# EAGLE design ProgrammerBoardV1 (EAGLE 8.0.1)
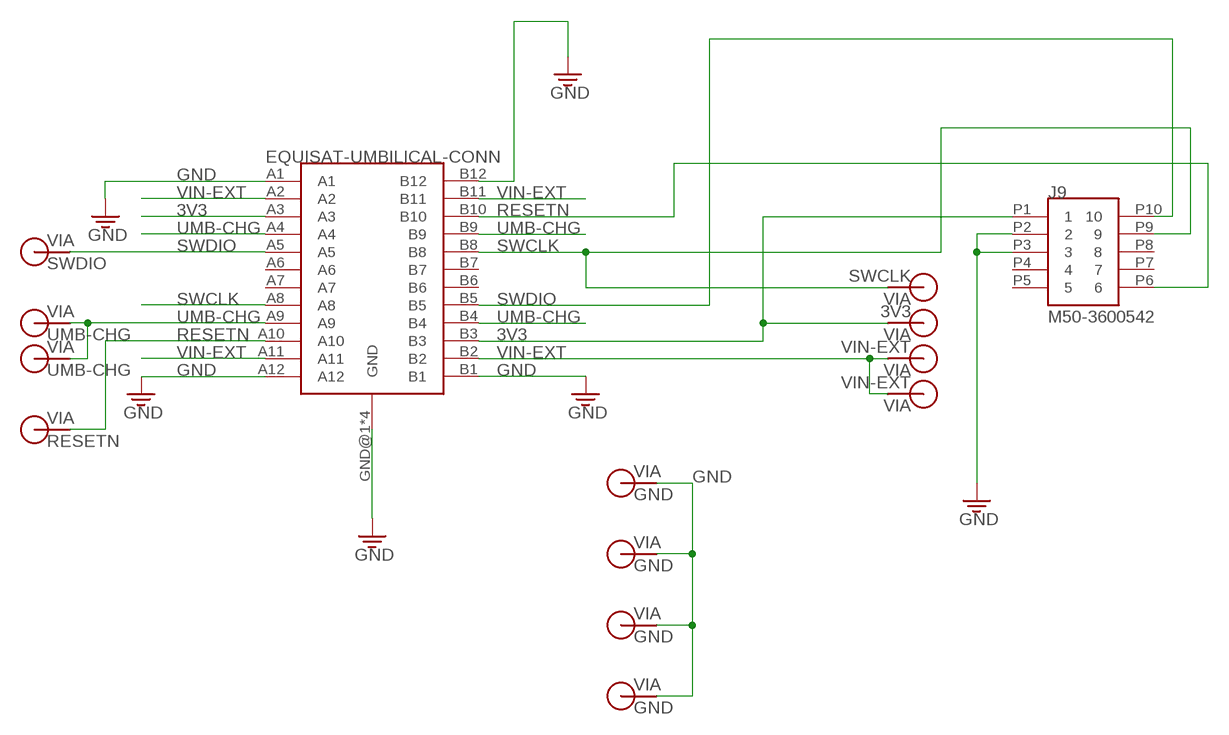
[diagram p0: schematic, sheet 1]

## Parts
J9  M50-3600542  10PINMALE  [10PINMALE]
U$1  EQUISAT-UMBILICAL-CONN  [USB-C-RCPT-SMT]
V1  GND  VIA-60MIL  [VIA-60MIL]
V2  GND  VIA-60MIL  [VIA-60MIL]
V3  GND  VIA-60MIL  [VIA-60MIL]
V4  GND  VIA-60MIL  [VIA-60MIL]
V5  SWDIO  VIA-60MIL  [VIA-60MIL]
V6  UMB-CHG  VIA-60MIL  [VIA-60MIL]
V7  UMB-CHG  VIA-60MIL  [VIA-60MIL]
V8  RESETN  VIA-60MIL  [VIA-60MIL]
V9  SWCLK  VIA-60MIL  [VIA-60MIL]
V10  3V3  VIA-60MIL  [VIA-60MIL]
V11  VIN-EXT  VIA-60MIL  [VIA-60MIL]
V12  VIN-EXT  VIA-60MIL  [VIA-60MIL]

## Nets
3V3: J9.P1 U$1.A3 U$1.B3 V10.P$1
GND: J9.P2 J9.P3 U$1.A1 U$1.A12 U$1.B1 U$1.B12 U$1.GND@1(GND) U$1.GND@2(GND) U$1.GND@3(GND) U$1.GND@4(GND) V1.P$1 V2.P$1 V3.P$1 V4.P$1
RESETN: J9.P6 U$1.A10 U$1.B10 V8.P$1
SWCLK: J9.P9 U$1.A8 U$1.B8 V9.P$1
SWDIO: J9.P10 U$1.A5 U$1.B5 V5.P$1
UMB-CHG: U$1.A4 U$1.A9 U$1.B4 U$1.B9 V6.P$1 V7.P$1
VIN-EXT: U$1.A2 U$1.A11 U$1.B2 U$1.B11 V11.P$1 V12.P$1
Unconnected: J9.P4 J9.P5 J9.P7 J9.P8 U$1.A6 U$1.A7 U$1.B6 U$1.B7

## Library data of the parts
J9 = BrownSpaceEngineering:10PINMALE
U$1 = BrownSpaceEngineering:EQUISAT-UMBILICAL-CONN
V1-V12 = BrownSpaceEngineering:VIA

## Board
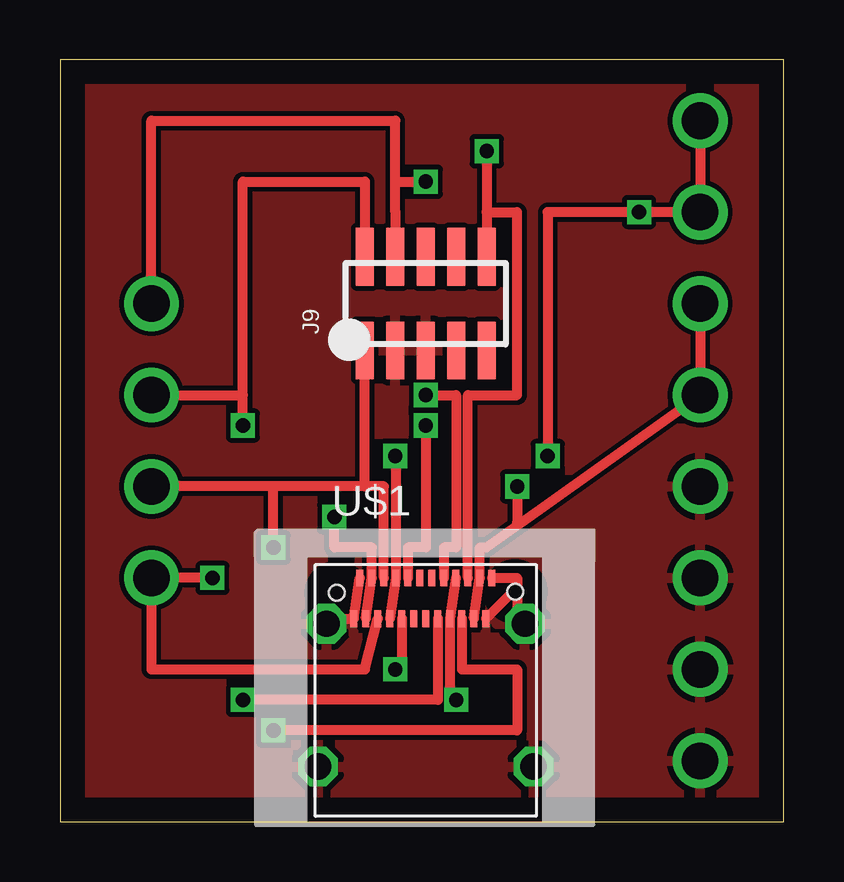
[diagram p1: board, top side]
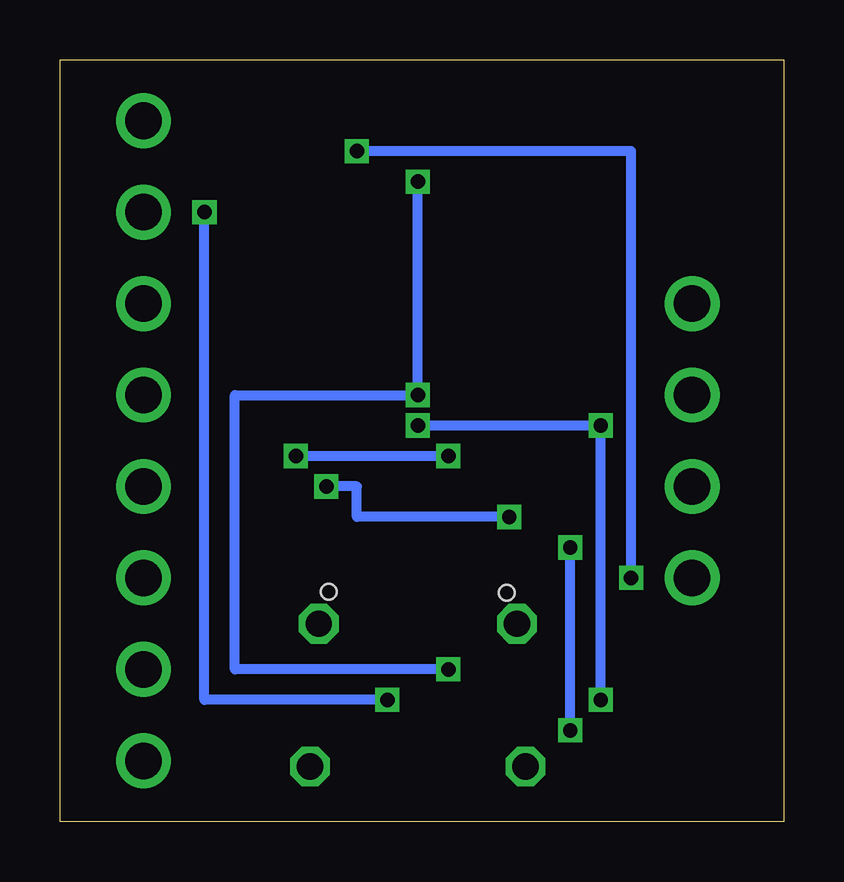
[diagram p2: board, bottom side, seen from below]

Size 30.15 x 31.74 mm. Coordinates in mm from the lower left corner, seen from the top.
Outline: 0,0 30.15,0 30.15,31.74 0,31.74 0,0
Copper layers (1*16): Top 0.035mm / dielectric 1.5mm / Bottom 0.035mm
Design rules "default": minimum track width 10mil, minimum drill 24mil, track to track 8mil, track to pad 8mil, pad to pad 8mil, via to via 8mil, smd to smd 8mil, copper to edge 40mil, drill to drill 8mil, minimum pad ring 10mil, minimum via ring 8mil, stop-mask expansion 4mil, vias tented up to drill 0mil, thermal gap 10mil

### Footprints (pad centres in the part's own frame; a part is rotated, then mirrored left to right if it is on the bottom)
10PINMALE = smd 0.74 x 2.4: P1 -2.54,-1.95; P2 -1.27,-1.95; P3 0,-1.95; P4 1.27,-1.95; P5 2.54,-1.95; P6 2.54,1.95; P7 1.27,1.95; P8 0,1.95; P9 -1.27,1.95; P10 -2.54,1.95
USB-C-RCPT-SMT = smd 0.3 x 0.7: A1 -2.75,0; A2 -2.25,0; A3 -1.75,0; A4 -1.25,0; A5 -0.75,0; A6 -0.25,0; A7 0.25,0; A8 0.75,0; A9 1.25,0; A10 1.75,0; A11 2.25,0; A12 2.75,0; B1 2.5,-1.7; B2 2,-1.7; B3 1.5,-1.7; B4 1,-1.7; B5 0.5,-1.7; B6 0,-1.7; B7 -0.5,-1.7; B8 -1,-1.7; B9 -1.5,-1.7; B10 -2,-1.7; B11 -2.5,-1.7; B12 -3,-1.7 | drill 1.1 pad 1.27 octagon: GND@1 -4.13,-1.91; GND@2 4.13,-1.91; GND@3 -4.49,-7.86; GND@4 4.49,-7.86 | hole 0.65: -3.7,-0.62; 3.72,-0.57
VIA-60MIL = drill 1.524: P$1 0,0

### Placement (x,y rotation side)
J9  15.24,21.59 0 top
U$1  15.24,10.16 0 top
V1  26.67,6.35 0 top
V2  26.67,10.16 0 top
V3  26.67,13.97 0 top
V4  26.67,2.54 0 top
V5  3.81,17.78 0 top
V6  26.67,29.21 0 top
V7  26.67,25.4 0 top
V8  3.81,10.16 0 top
V9  3.81,21.59 0 top
V10  3.81,13.97 0 top
V11  26.67,21.59 0 top
V12  26.67,17.78 0 top

### Tracks (layer width: path | path; a pad name or v marks a point on that pad's centre or on a via)
3V3  (via drill 0.6)
  Top 0.406: 8.89,13.97 V10.P$1 | 12.7,13.97 8.89,13.97 | 12.7,13.97 J9.P1 | v8.89,11.43 8.89,13.97 | U$1.B3 16.74,6.35 19.05,6.35 19.05,3.81 v8.89,3.81 | U$1.A3 13.49,13.97 12.7,13.97
  Bottom 0.406: v8.89,3.81 v8.89,11.43
GND
  Top 0.406: U$1.A12 19.05,10.16 19.05,9.77 | 19.05,9.77 U$1.B1 | 19.05,9.77 19.05,8.57 U$1.GND@2 | 11.43,8.57 arc-90 U$1.GND@1 11.32,8.46 U$1.B12 U$1.A1
  pour Top: -3.81,36.83 33.02,36.83 33.02,-5.08 -3.81,-5.08
RESETN  (via drill 0.6)
  Top 0.406: U$1.B10 12.7,6.35 3.81,6.35 V8.P$1 v6.35,10.16 | U$1.A10 16.99,17.78 19.05,17.78 19.05,25.4 17.78,25.4 | 17.78,25.4 J9.P6 | v17.78,27.94 17.78,25.4
  Bottom 0.406: v17.78,27.94 6.35,27.94 v6.35,10.16
SWCLK  (via drill 0.6)
  Top 0.406: 13.97,26.67 13.97,25.4 J9.P9 | 13.97,26.67 13.97,29.21 3.81,29.21 V9.P$1 | U$1.B8 14.24,6.35 v13.97,6.35 | v15.24,17.78 16.51,17.78 16.51,11.43 15.99,11.43 U$1.A8 | 13.97,26.67 v15.24,26.67
  Bottom 0.406: v15.24,26.67 v15.24,17.78 22.86,17.78 22.86,6.35 v13.97,6.35
SWDIO  (via drill 0.6)
  Top 0.406: V5.P$1 7.62,17.78 | J9.P10 12.7,26.67 7.62,26.67 7.62,17.78 | v7.62,16.51 7.62,17.78 | U$1.B5 15.74,5.08 v7.62,5.08 | v15.24,16.51 15.24,11.43 14.49,11.43 U$1.A5
  Bottom 0.406: v7.62,5.08 v7.62,16.51 v15.24,16.51
UMB-CHG  (via drill 0.6)
  Top 0.406: V6.P$1 V7.P$1 v24.13,25.4 20.32,25.4 v20.32,15.24 | U$1.A9 U$1.B4 16.24,5.08 v16.51,5.08 | U$1.B9 U$1.A4 13.99,15.24 v13.97,15.24
  Bottom 0.406: v20.32,15.24 v13.97,15.24 | v16.51,5.08 24.13,5.08 v24.13,25.4
VIN-EXT  (via drill 0.6)
  Top 0.406: U$1.B11 U$1.A2 12.99,11.43 11.43,11.43 v11.43,12.7 | U$1.B2 U$1.A11 17.49,11.43 17.78,11.43 19.22,12.46 | V11.P$1 V12.P$1 19.22,12.46 | v19.05,13.97 19.05,12.46 19.22,12.46
  Bottom 0.406: v11.43,12.7 17.78,12.7 17.78,13.97 v19.05,13.97